# Altium schematic sheet Power.SchDoc
size Letter
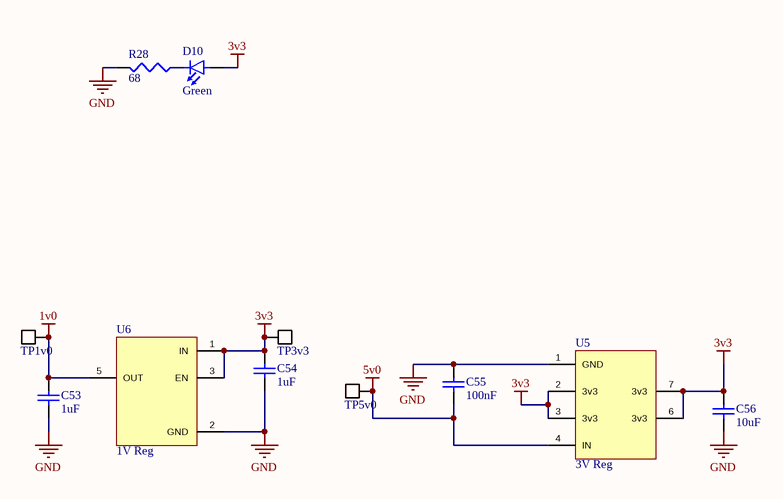
[diagram p0: Power.SchDoc]

## Parts
C53  value 1uF  [SMD0603]  (hidden comment: Cap)
C54  value 1uF  [SMD0603]  (hidden comment: Cap)
C55  value 100nF  [SMD0603]  (hidden comment: Cap)
C56  value 10uF  [SMD0603]  (hidden comment: Cap)
D10  Color: Green  [SMD0805_LED]  (hidden comment: LED)
R28  value 68  [SMD0603]  (hidden comment: Res)
TP1v0  Test Point  [Test Point]  (value not drawn)
TP3v3  Test Point  [Test Point]  (value not drawn)
TP5v0  Test Point  [Test Point]  (value not drawn)
U5  3V Reg  [SOIC8]
U6  1V Reg  [SOT23-5Lead]

## Nets
1v0: C53.2 TP1v0.1 U6.5(OUT)
3v3: C54.2 C56.2 D10.1(Anode_(+)) TP3v3.1 U5.2(3v3) U5.3(3v3) U5.6(3v3) U5.7(3v3) U6.1(IN) U6.3(EN)
5v0: C55.1 TP5v0.1 U5.4(IN)
GND: C53.1 C54.1 C55.2 C56.1 R28.2 U5.1(GND) U6.2(GND)
NetD10_2: D10.2(Cathode_(-)) R28.1

## Library data of the parts
C53-C56 = Capacitor Ceramic: Ceramic Chip Capacitor
R28 = Resistor
TP1v0 TP3v3 TP5v0 = Test Point: Supplier 1: Digi-Key; Supplier Part Number 1: 5019KCT-ND